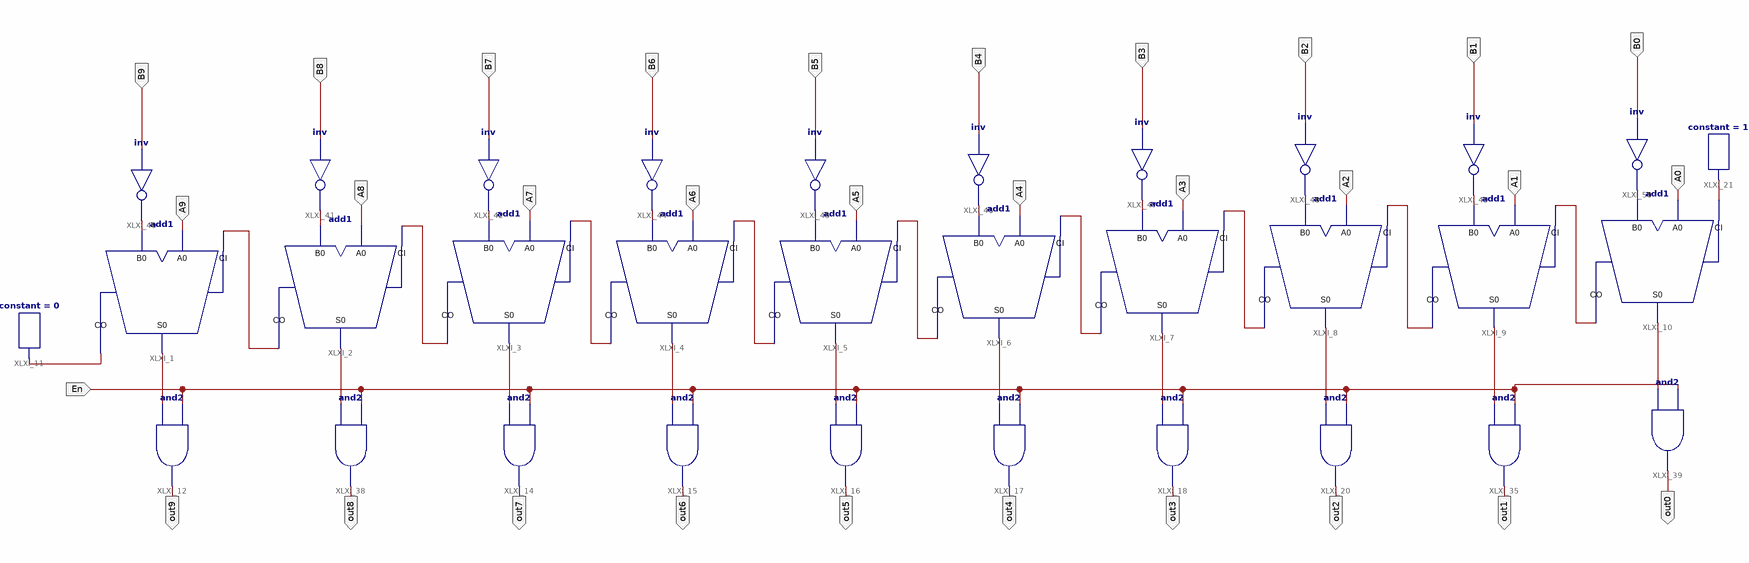
[diagram p0: schematic sheet 1]
// Xilinx ISE schematic subtrack_def2.sch (xc9500xl) as structural Verilog: 32 symbols, 31 ports
module subtrack_def2 (
  input  A9,
  input  A8,
  input  A7,
  input  A6,
  input  A5,
  input  A4,
  input  A3,
  input  A2,
  input  A1,
  input  A0,
  input  B9,
  input  B8,
  input  B7,
  input  B6,
  input  B5,
  input  B4,
  input  B3,
  input  B2,
  input  B1,
  input  B0,
  input  En,
  output out9,
  output out8,
  output out7,
  output out6,
  output out5,
  output out4,
  output out3,
  output out2,
  output out1,
  output out0
);

  wire XLXN_11, XLXN_12, XLXN_13, XLXN_14, XLXN_15, XLXN_16, XLXN_17, XLXN_18, XLXN_19, XLXN_20, XLXN_31,
       XLXN_32, XLXN_33, XLXN_34, XLXN_35, XLXN_36, XLXN_37, XLXN_38, XLXN_39, XLXN_40, XLXN_41, XLXN_42,
       XLXN_63, XLXN_64, XLXN_65, XLXN_66, XLXN_67, XLXN_68, XLXN_69, XLXN_70, XLXN_83;

  add1 XLXI_1 (.A0(A9), .B0(XLXN_11), .CI(XLXN_31), .CO(XLXN_41), .S0(XLXN_42));
  add1 XLXI_2 (.A0(A8), .B0(XLXN_12), .CI(XLXN_32), .CO(XLXN_31), .S0(XLXN_70));
  add1 XLXI_3 (.A0(A7), .B0(XLXN_13), .CI(XLXN_33), .CO(XLXN_32), .S0(XLXN_69));
  add1 XLXI_4 (.A0(A6), .B0(XLXN_14), .CI(XLXN_34), .CO(XLXN_33), .S0(XLXN_68));
  add1 XLXI_5 (.A0(A5), .B0(XLXN_15), .CI(XLXN_35), .CO(XLXN_34), .S0(XLXN_67));
  add1 XLXI_6 (.A0(A4), .B0(XLXN_16), .CI(XLXN_36), .CO(XLXN_35), .S0(XLXN_66));
  add1 XLXI_7 (.A0(A3), .B0(XLXN_17), .CI(XLXN_37), .CO(XLXN_36), .S0(XLXN_65));
  add1 XLXI_8 (.A0(A2), .B0(XLXN_18), .CI(XLXN_38), .CO(XLXN_37), .S0(XLXN_64));
  add1 XLXI_9 (.A0(A1), .B0(XLXN_19), .CI(XLXN_39), .CO(XLXN_38), .S0(XLXN_63));
  add1 XLXI_10 (.A0(A0), .B0(XLXN_20), .CI(XLXN_40), .CO(XLXN_39), .S0(XLXN_83));
  constant #(.CValue("0")) XLXI_11 (.O(XLXN_41));
  and XLXI_12 (out9, XLXN_42, En);
  and XLXI_38 (out8, XLXN_70, En);
  and XLXI_14 (out7, XLXN_69, En);
  and XLXI_15 (out6, XLXN_68, En);
  and XLXI_16 (out5, XLXN_67, En);
  and XLXI_17 (out4, XLXN_66, En);
  and XLXI_18 (out3, XLXN_65, En);
  and XLXI_35 (out1, XLXN_63, En);
  and XLXI_20 (out2, XLXN_64, En);
  and XLXI_39 (out0, XLXN_83, En);
  constant #(.CValue("1")) XLXI_21 (.O(XLXN_40));
  not XLXI_40 (XLXN_11, B9);
  not XLXI_41 (XLXN_12, B8);
  not XLXI_42 (XLXN_13, B7);
  not XLXI_44 (XLXN_14, B6);
  not XLXI_45 (XLXN_15, B5);
  not XLXI_46 (XLXN_16, B4);
  not XLXI_47 (XLXN_17, B3);
  not XLXI_48 (XLXN_18, B2);
  not XLXI_49 (XLXN_19, B1);
  not XLXI_50 (XLXN_20, B0);
endmodule
